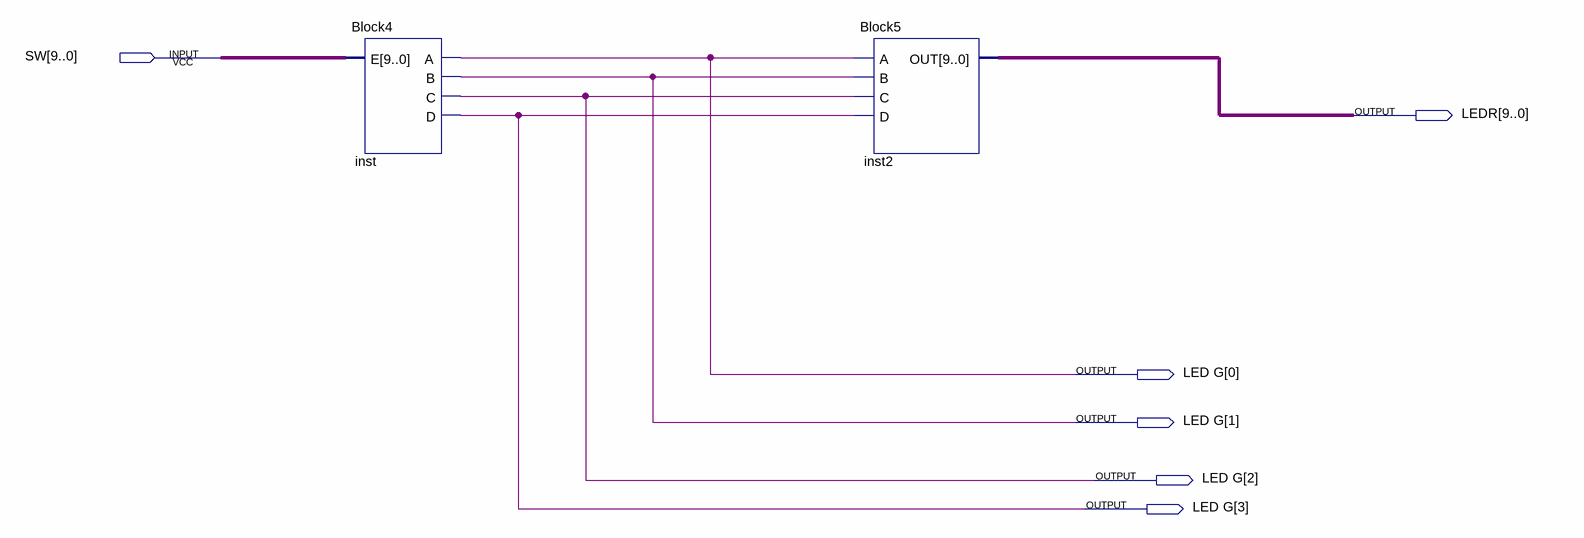
[diagram p0: schematic sheet]
// Quartus schematic Block6.bdf as structural Verilog: 2 symbols, 6 pins
module Block6 (
  input  [9:0] SW,
  output [9:0] LEDR,
  output [3:0] \LED_G 
);

  Block4 inst (.E(SW), .A(\LED_G [0]), .B(\LED_G [1]), .C(\LED_G [2]), .D(\LED_G [3]));
  Block5 inst2 (.A(\LED_G [0]), .B(\LED_G [1]), .C(\LED_G [2]), .D(\LED_G [3]), .OUT(LEDR));
endmodule
